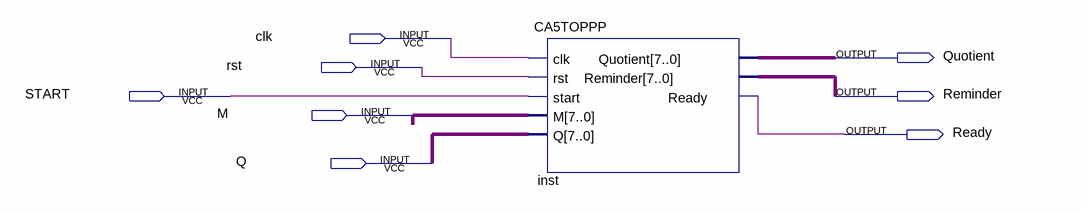
[diagram p0: schematic sheet]
// Quartus schematic QPP.bdf as structural Verilog: 1 symbols, 8 pins
module QPP (
  input  clk,
  input  rst,
  input  START,
  input  M,
  input  Q,
  output Quotient,
  output Reminder,
  output Ready
);

  wire [7:0] inst_quotient, inst_reminder, undriven, undriven_2;

  CA5TOPPP inst (
    .clk(clk), .rst(rst), .start(START), .M(undriven), .Q(undriven_2), .Quotient(inst_quotient),
    .Reminder(inst_reminder), .Ready(Ready));
endmodule
